# EAGLE design untitled (EAGLE 7.7.0)
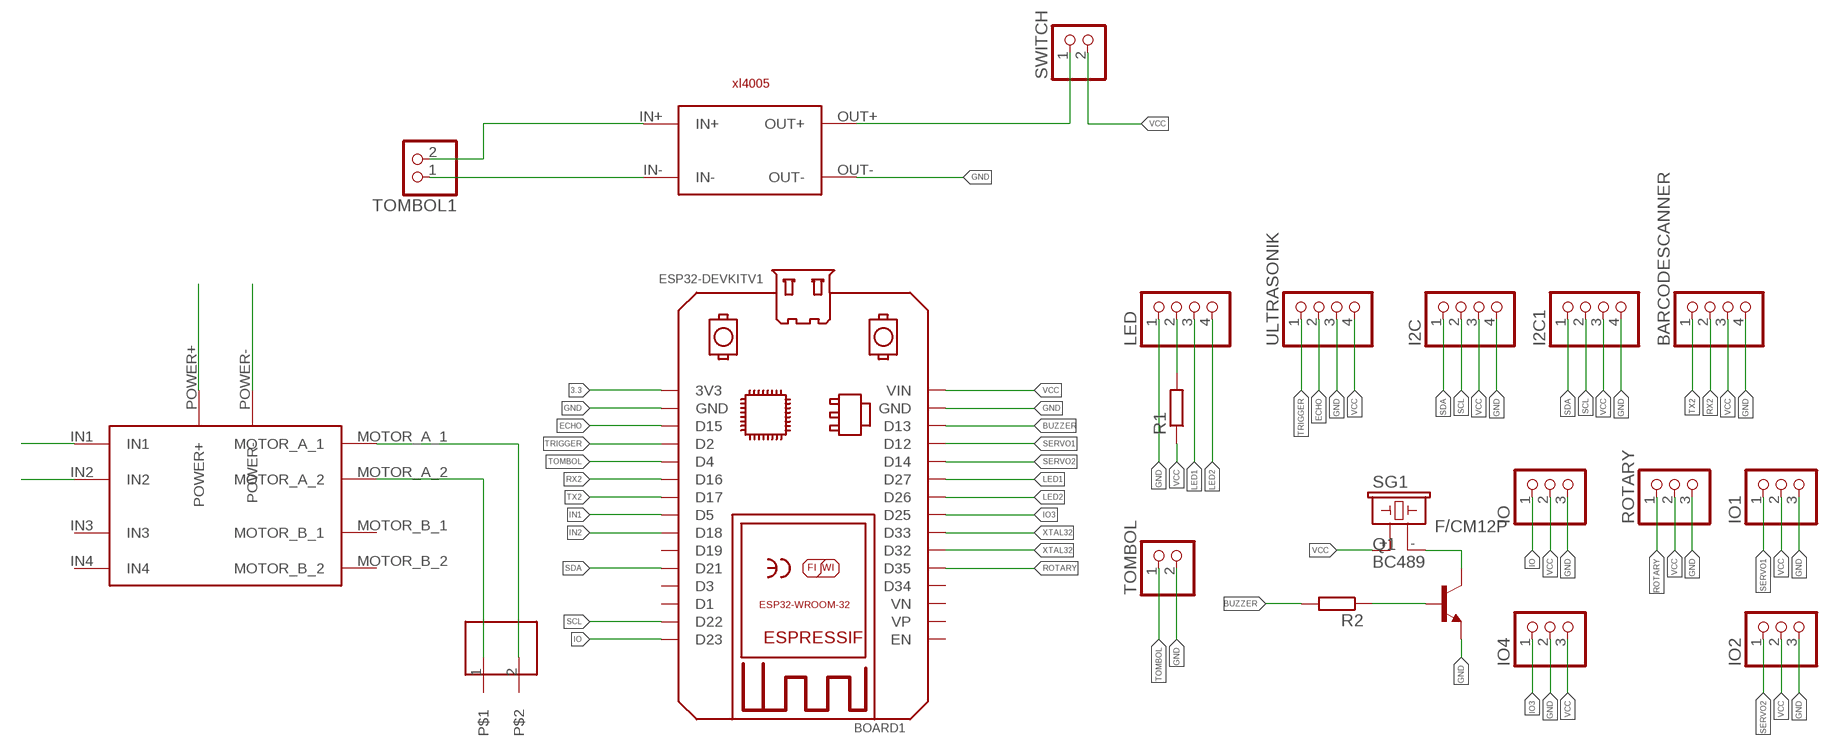
[diagram p0: schematic, sheet 1]

## Parts
BARCODESCANNER  PINHD-1X4  [1X04]
BOARD1  ESP32DEVKITV1SHRIDATTDUDHAT  [ESP32-DEVKITV1]
I2C  PINHD-1X4  [1X04]
I2C1  PINHD-1X4  [1X04]
IO  PINHD-1X3  [1X03]
IO1  PINHD-1X3  [1X03]
IO2  PINHD-1X3  [1X03]
IO4  PINHD-1X3  [1X03]
LED  PINHD-1X4  [1X04]
Q1  BC489  [TO92-EBC]
R1  R-EU_0207/10  [0207/10]
R2  R-EU_0207/10  [0207/10]
ROTARY  PINHD-1X3  [1X03]
SG1  F/CM12P  [F/CM12P]
SWITCH  PINHD-1X2  [1X02]
TOMBOL  PINHD-1X2  [1X02]
TOMBOL1  PINHD-1X2  [1X02]
U$1  DRIVERMOTOR_MINI  [DRIVERMOTOR_MINI]
U$2  DC-STEP-DOWN-XL4005  [DC-STEP-DOWN-XL4005]
U$3  TERMINALBLOCK2  [TERMINALBLOCK2]
ULTRASONIK  PINHD-1X4  [1X04]

## Nets
3.3: BOARD1.3V3
BUZZER: BOARD1.D13 R2.2
ECHO: BOARD1.D15 ULTRASONIK.2
GND: BARCODESCANNER.4 BOARD1.GND BOARD1.GND@1(GND) I2C1.4 I2C.4 IO1.3 IO2.3 IO4.2 IO.3 LED.1 Q1.E ROTARY.3 TOMBOL.2 U$1.POWER- U$2.OUT- ULTRASONIK.3
IN1: BOARD1.D5 U$1.IN1
IN2: BOARD1.D18 U$1.IN2
IO: BOARD1.D23 IO.1
IO3: BOARD1.D25 IO4.1
LED1: BOARD1.D27 LED.3
LED2: BOARD1.D26 LED.4
N$1: TOMBOL1.1 U$2.IN-
N$2: TOMBOL1.2 U$2.IN+
N$3: LED.2 R1.2
N$4: SWITCH.1 U$2.OUT+
N$6: U$1.MOTOR_A_1 U$3.2
N$8: U$1.MOTOR_A_2 U$3.1
N$13: Q1.C SG1.-
N$14: Q1.B R2.1
ROTARY: BOARD1.D35 ROTARY.1
RX2: BARCODESCANNER.2 BOARD1.D16
SCL: BOARD1.D22 I2C1.2 I2C.2
SDA: BOARD1.D21 I2C1.1 I2C.1
SERVO1: BOARD1.D12 IO1.1
SERVO2: BOARD1.D14 IO2.1
TOMBOL: BOARD1.D4 TOMBOL.1
TRIGGER: BOARD1.D2 ULTRASONIK.1
TX2: BARCODESCANNER.1 BOARD1.D17
VCC: BARCODESCANNER.3 BOARD1.VIN I2C1.3 I2C.3 IO1.2 IO2.2 IO4.3 IO.2 R1.1 ROTARY.2 SG1.+ SWITCH.2 U$1.POWER+ ULTRASONIK.4
XTAL32: BOARD1.D32 BOARD1.D33
Unconnected: BOARD1.D1 BOARD1.D3 BOARD1.D19 BOARD1.D34 BOARD1.EN BOARD1.VN BOARD1.VP U$1.IN3 U$1.IN4 U$1.MOTOR_B_1 U$1.MOTOR_B_2

## Library data of the parts
BARCODESCANNER I2C I2C1 LED ULTRASONIK = pinhead:PINHD-1X4: PIN HEADER
BOARD1 = ESP32-DEVKITV1:ESP32DEVKITV1: https://github.com/shridattdudhat
IO IO1 IO2 IO4 ROTARY = pinhead:PINHD-1X3: PIN HEADER
Q1 = transistor-npn:BC489*: NPN Transistor
R1 R2 = rcl:R-EU_: RESISTOR, European symbol
SG1 = buzzer:F/CM12P: BUZZER Source: Buerklin
SWITCH TOMBOL TOMBOL1 = pinhead:PINHD-1X2: PIN HEADER
U$1 = driver motor mini:DRIVERMOTOR_MINI
U$2 = diy-modules:DC-STEP-DOWN-XL4005
U$3 = pinhead:TERMINALBLOCK2

## Board
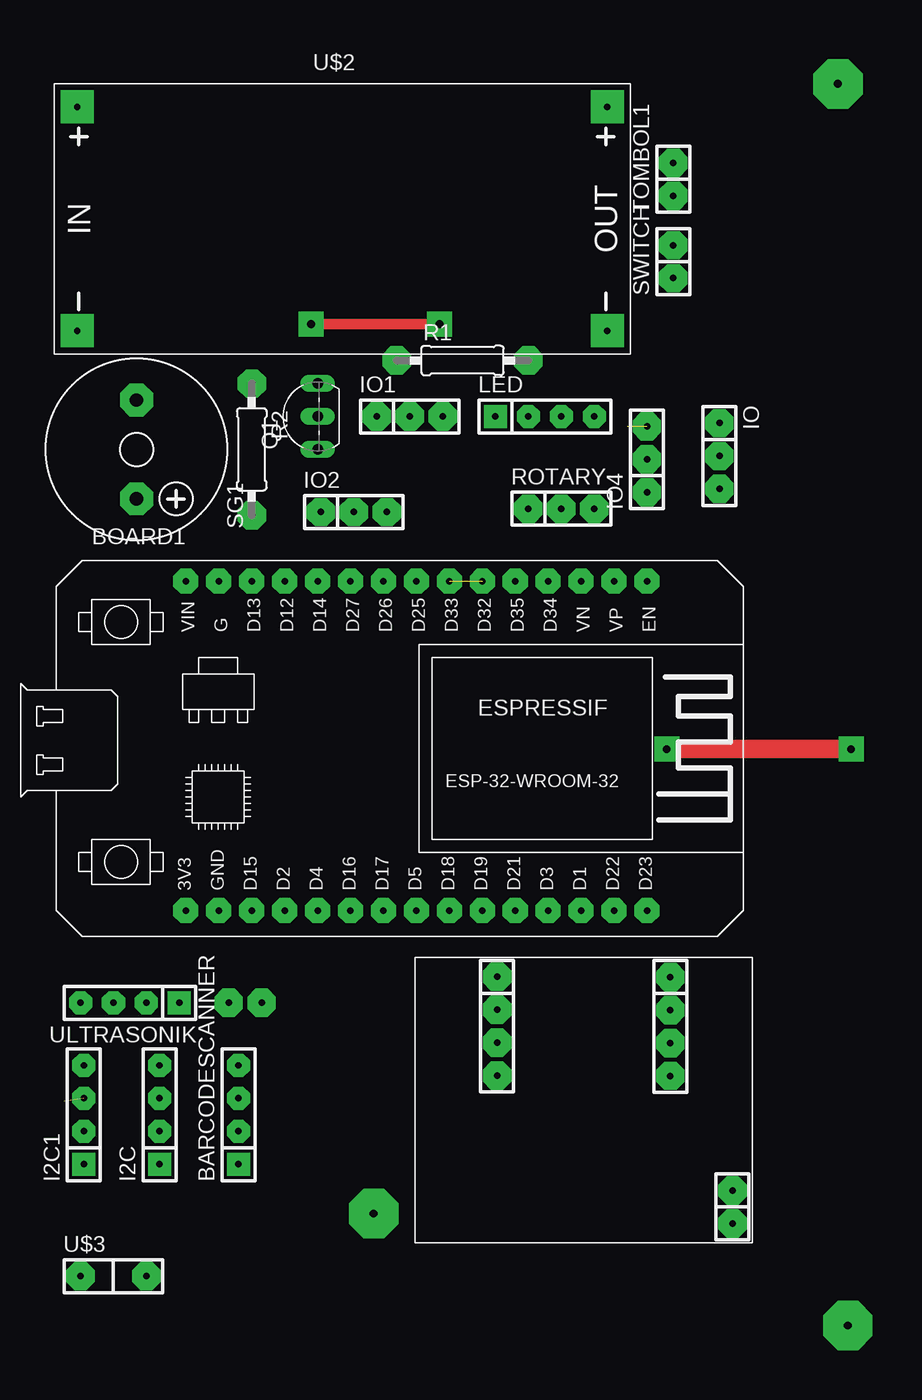
[diagram p1: board, top side]
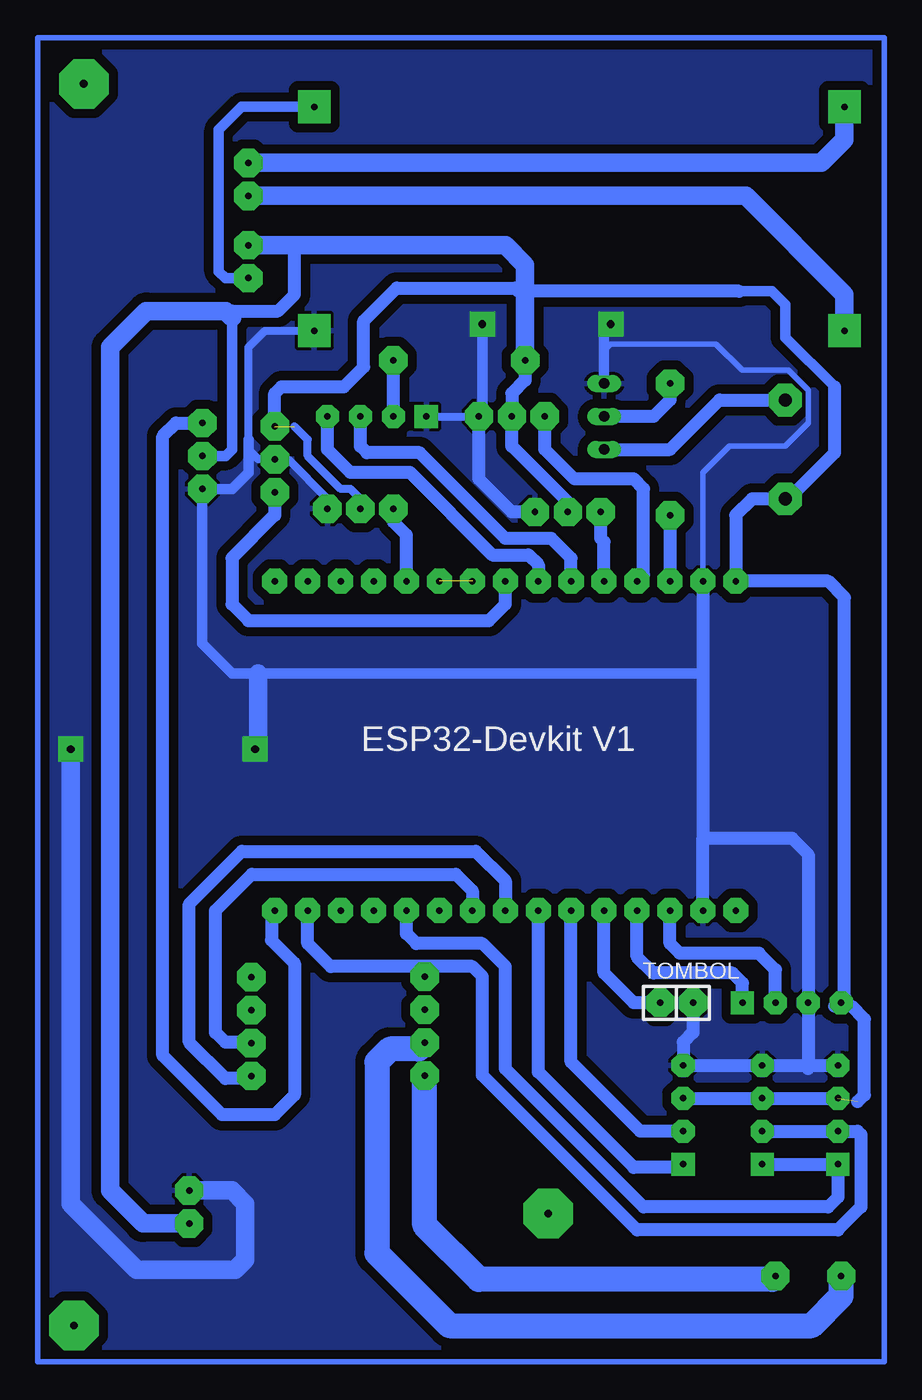
[diagram p2: board, bottom side, seen from below]

No outline drawn. Coordinates in mm, seen from the top.
Copper layers (1*16): Top 0.035mm / dielectric 1.5mm / Bottom 0.035mm
Design rules "default *": minimum track width 10mil, minimum drill 24mil, track to track 28mil, track to pad 28mil, pad to pad 28mil, via to via 28mil, smd to smd 8mil, copper to edge 40mil, drill to drill 28mil, minimum pad ring 10mil, minimum via ring 8mil, stop-mask expansion 4mil, vias tented up to drill 0mil, thermal gap 10mil

### Footprints (pad centres in the part's own frame; a part is rotated, then mirrored left to right if it is on the bottom)
1X04 = drill 0.5 pad 1.778 square: 1 -3.81,0 | drill 0.5 pad 1.778 octagon: 2 -1.27,0; 3 1.27,0; 4 3.81,0
ESP32-DEVKITV1 = drill 0.5 pad 1.93 octagon: 3V3 0,0; D1 30.48,0; D2 7.62,0; D3 27.94,0; D4 10.16,0; D5 17.78,0; D12 7.62,25.4; D13 5.08,25.4; D14 10.16,25.4; D15 5.08,0; D16 12.7,0; D17 15.24,0; D18 20.32,0; D19 22.86,0; D21 25.4,0; D22 33.02,0; D23 35.56,0; D25 17.78,25.4; D26 15.24,25.4; D27 12.7,25.4; D32 22.86,25.4; D33 20.32,25.4; D34 27.94,25.4; D35 25.4,25.4; EN 35.56,25.4; GND 2.54,25.4; GND@1 2.54,0; VIN 0,25.4; VN 30.48,25.4; VP 33.02,25.4
1X03 = drill 0.5 pad 2.184 octagon: 1 -2.54,0; 2 0,0; 3 2.54,0
TO92-EBC = drill 0.813 long: B 0,-1.27; C -2.54,-1.27; E 2.54,-1.27
0207/10 = drill 0.5 pad 2.184 octagon: 1 -5.08,0; 2 5.08,0
F/CM12P = drill 1.016 pad 2.54 octagon: + 3.81,0; - -3.81,0
1X02 = drill 0.5 pad 2.184 octagon: 1 -1.27,0; 2 1.27,0
DRIVERMOTOR_MINI = drill 0.5 pad 2.184 octagon: IN1 -6.629,-3.759; IN2 -6.629,-6.299; IN3 -6.629,-8.839; IN4 -6.629,-11.379; MOTOR_A_1 6.731,-3.785; MOTOR_A_2 6.731,-6.325; MOTOR_B_1 6.731,-8.865; MOTOR_B_2 6.731,-11.405; POWER+ -11.43,7.62; POWER- -11.43,5.08
DC-STEP-DOWN-XL4005 = drill 0.5 pad 2.54 square: IN+ -19.812,8.636; IN- -19.812,-8.636; OUT+ 21.082,8.636; OUT- 21.082,-8.636
TERMINALBLOCK2 = drill 0.5 pad 2.184 octagon: 1 -3.81,0; 2 1.27,0

### Placement (x,y rotation side)
BARCODESCANNER  15.49,21.08 90 top
BOARD1  11.43,36.83 0 top
I2C  9.4,21.08 90 top
I2C1  3.56,21.08 90 top
IO  52.58,71.88 270 top
IO1  28.7,74.93 0 top
IO2  24.38,67.56 0 top
IO4  46.99,71.63 90 top
LED  39.12,74.93 0 top
Q1  20.32,74.93 90 top
R1  32.77,79.25 0 top
R2  16.51,72.39 270 top
ROTARY  40.39,67.82 0 top
SG1  7.62,72.39 270 top
SWITCH  49.02,86.87 90 top
TOMBOL  16,29.72 0 bottom
TOMBOL1  49.02,93.22 90 top
U$1  42.16,20.32 180 top
U$2  22.86,90.17 0 top
U$3  7.11,8.64 0 top
ULTRASONIK  7.11,29.72 180 top

### Tracks (layer width: path | path; a pad name or v marks a point on that pad's centre or on a via)
BUZZER
  Bottom 1.016: R2.2 BOARD1.D13
ECHO
  Bottom 1.016: ULTRASONIK.2 8.38,32.26 9.65,33.53 15.75,33.53 16.51,34.29 BOARD1.D15
GND  (via drill 0.6 pad 1.93)
  Top 0.813: v30.99,82.04 v21.08,82.04
  Top 1.422: v62.74,49.28 v48.51,49.28
  Bottom 0.406: 21.59,80.01 21.08,80.52 12.95,80.52 10.92,78.49 7.37,78.49 5.84,76.96 5.84,74.42 7.62,72.64 11.94,72.64 13.97,70.61 BOARD1.GND
  Bottom 0.61: ROTARY.3 42.93,68.58 45.97,71.63 IO4.2 48.26,71.63 49.02,72.39 49.02,73.15 49.02,80.26 47.75,81.53 U$2.OUT- | LED.1 IO1.3 | Q1.E 21.59,78.23 21.59,80.01
  Bottom 0.813: 49.02,73.15 49.02,70.61 50.29,69.34 IO.3 52.58,57.4 50.29,55.12 48.26,55.12 13.97,55.12 | IO1.3 30.99,75.18 v30.99,82.04 | v21.08,82.04 21.59,81.53 21.59,78.23
  Bottom 1.016: IO2.3 28.7,67.56 31.24,70.1 IO1.3 | I2C1.4 I2C.4 BARCODESCANNER.4 15.49,26.67 14.73,27.43 TOMBOL.2 | 5.84,24.64 ULTRASONIK.3 5.84,41.15 7.11,42.42 13.97,42.42 | BOARD1.GND 13.97,55.12 13.97,42.42 | BOARD1.GND@1 13.97,42.42
  Bottom 1.422: U$1.POWER- 50.29,15.24 49.28,14.22 49.28,9.91 50.04,9.14 57.66,9.14 62.74,14.22 v62.74,49.28 | v48.51,49.28 48.26,49.53 48.26,55.12
  pour Bottom: 1.02,104.14 65.28,104.14 65.28,2.03 0,2.03 0,104.14
IN1
  Bottom 1.016: U$1.IN1 49,23.88 50.8,23.88 53.59,26.67 53.59,37.34 49.53,41.4 31.5,41.4 29.21,39.12 BOARD1.D5
IN2
  Bottom 1.016: U$1.IN2 48.84,26.67 50.8,26.67 51.56,27.43 51.56,36.83 48.77,39.62 33.02,39.62 31.75,38.35 BOARD1.D18
IO
  Bottom 1.016: BOARD1.D23 47.24,36.58 47.24,34.54 45.47,32.77 45.47,22.61 46.99,21.08 51.05,21.08 55.63,25.65 55.63,73.41 54.61,74.42 IO.1
IO3
  Bottom 1.016: IO4.1 46.99,67.31 50.29,64.01 50.29,60.45 49.02,59.18 30.48,59.18 29.21,60.45 BOARD1.D25
LED1
  Bottom 1.016: BOARD1.D27 24.13,64.01 25.65,65.53 29.21,65.53 35.81,72.14 39.88,72.14 40.39,72.64 LED.3
LED2
  Bottom 1.016: BOARD1.D26 26.67,63.5 27.43,64.26 30.23,64.26 36.58,70.61 41.15,70.61 42.93,72.39 LED.4
N$1
  Bottom 1.422: U$2.IN- 3.05,84.33 10.67,91.95 TOMBOL1.1
N$2
  Bottom 1.422: TOMBOL1.2 4.83,94.49 3.05,96.27 U$2.IN+
N$3
  Bottom 1.016: LED.2 R1.2
N$4
  Bottom 0.813: SWITCH.1 50.8,85.6 51.31,86.11 51.31,97.03 49.53,98.81 U$2.OUT+
N$5
  Bottom 0.406: 0,2.03 65.28,2.03 65.28,104.14 0,104.14 0,2.03
N$6
  Bottom 1.93: U$3.2 8.64,8.38 31.24,8.38 35.43,12.57 U$1.MOTOR_A_1
N$7  (via drill 0.6 pad 3.81)
  other vias: 62.48,4.83
N$8
  Bottom 1.93: U$1.MOTOR_A_2 35.92,26.16 38.1,26.16 39.12,25.15 39.12,10.41 33.53,4.83 5.59,4.83 3.3,7.11 U$3.1
N$9  (via drill 0.6 pad 3.81)
  other vias: 61.72,100.58
N$10  (via drill 0.6 pad 3.81)
  other vias: 25.91,13.46
N$13
  Bottom 1.016: Q1.C 16.51,72.39 12.7,76.2 SG1.-
N$14
  Bottom 1.016: R2.1 16.51,76.2 17.78,74.93 Q1.B
ROTARY
  Bottom 1.016: BOARD1.D35 36.83,65.79 37.85,66.8 ROTARY.1
RX2
  Bottom 1.016: BARCODESCANNER.2 18.8,19.81 24.13,25.15 BOARD1.D16
SCL
  Bottom 1.016: I2C.2 I2C1.2 2.03,19.81 1.78,19.56 1.78,13.97 3.56,12.19 19.05,12.19 30.99,24.13 30.99,31.75 31.75,32.51 42.67,32.51 44.45,34.29 BOARD1.D22
SDA
  Bottom 1.016: I2C.1 I2C1.1 3.56,14.73 4.32,13.97 18.54,13.97 29.21,24.64 29.21,32.51 30.99,34.29 36.07,34.29 36.83,35.05 BOARD1.D21
SERVO1
  Bottom 1.016: BOARD1.D12 18.54,62.74 18.54,69.34 19.3,70.1 23.88,70.1 26.16,72.39 IO1.1
SERVO2
  Bottom 1.016: BOARD1.D14 21.59,65.28 21.84,65.53 IO2.1
TOMBOL
  Bottom 1.016: TOMBOL.1 19.3,29.72 21.59,32 BOARD1.D4
TRIGGER
  Bottom 1.016: ULTRASONIK.1 10.92,31.24 11.68,32 17.78,32 19.05,33.27 BOARD1.D2
TX2
  Bottom 1.016: BARCODESCANNER.1 15.75,17.02 19.3,17.02 26.67,24.38 BOARD1.D17
VCC  (2 unrouted)
  Bottom 0.61: ROTARY.2 40.39,68.58 41.15,69.34 41.91,69.34 44.45,71.88 44.45,73.15 45.47,74.17
  Bottom 0.813: 3.81,77.22 7.62,81.03 7.62,83.57 8.64,84.58 11.18,84.58 | IO.2 50.8,71.88 50.29,72.39 50.29,82.55 50.29,83.06
  Bottom 1.016: IO2.2 24.38,68.33 28.7,72.64 IO1.2 28.7,76.71 27.69,77.72 R1.1 | IO4.3 46.99,76.71 46.48,77.22 41.66,77.22 40.13,78.74 40.13,82.3 37.59,84.84 28.45,84.84 28.19,84.58 27.69,84.58 11.18,84.58 | I2C1.3 I2C.3 BARCODESCANNER.3 | 2.03,22.1 1.52,22.61 1.52,28.45 2.54,29.46 3.81,29.46 3.56,29.72 | 3.56,29.72 ULTRASONIK.4 | 50.29,83.06 46.74,83.06 45.47,84.33 45.47,88.14 | 3.56,29.72 3.05,30.23 3.05,60.96 4.32,62.23 BOARD1.VIN 11.43,67.31 10.16,68.58 SG1.+ 7.37,68.58 3.81,72.14 3.81,77.22
  Bottom 1.422: SWITCH.2 45.47,88.14 29.21,88.14 27.69,86.61 27.69,84.58 R1.1 | U$1.POWER+ 57.15,12.7 59.69,15.24 59.69,80.26 56.9,83.06 50.8,83.06 50.29,82.55
XTAL32  (1 unrouted)